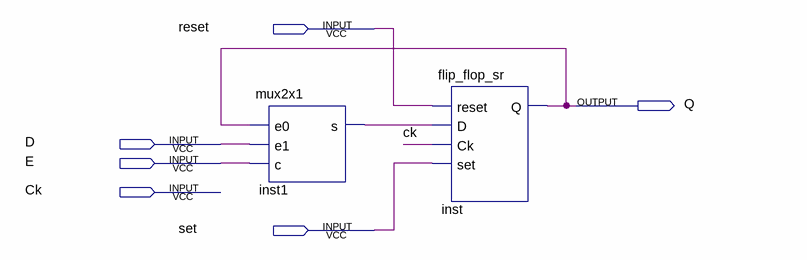
[diagram p0: schematic sheet]
// Quartus schematic flip_flop_E_sr.bdf as structural Verilog: 2 symbols, 6 pins
module flip_flop_E_sr (
  input  reset,
  input  D,
  input  E,
  input  Ck,
  input  set,
  output Q
);

  wire inst1_s;

  mux2x1 inst1 (.e0(Q), .e1(D), .c(E), .s(inst1_s));
  flip_flop_sr inst (.reset(reset), .D(inst1_s), .Ck(Ck), .set(set), .Q(Q));
endmodule
